# EAGLE design TR Switch (EAGLE 7.2.0)
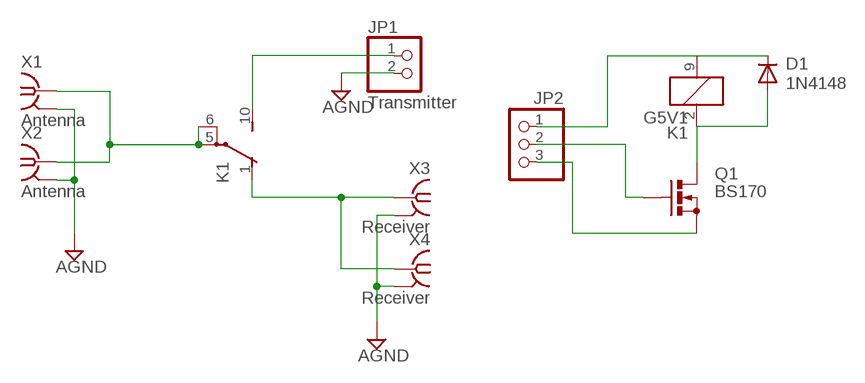
[diagram p0: schematic, sheet 1]

## Parts
D1  1N4148  1N4148DO35-7  [DO35-7]
JP1  Transmitter  PINHD-1X2  [1X02]
JP2  PINHD-1X3  [1X03]
K1  G5V1  [G5V1]
Q1  BS170  [SOT54E]
X1  Antenna  SMA-142-0711-821/826  [J502-ND-142-0711-821/826]
X2  Antenna  BU-SMA-V  [BU-SMA-V]
X3  Receiver  SMA-142-0711-821/826  [J502-ND-142-0711-821/826]
X4  Receiver  BU-SMA-V  [BU-SMA-V]

## Nets
AGND: JP1.2 X1.G@1 X1.G@2 X1.G@3 X1.G@4 X2.2 X2.3 X2.4 X2.5 X3.G@1 X3.G@2 X3.G@3 X3.G@4 X4.2 X4.3 X4.4 X4.5
N$1: D1.A K1.2 Q1.D
N$2: D1.C JP2.1 K1.9
N$3: K1.5(2:P) K1.6(2:P) X1.1 X2.1
N$4: JP2.3 Q1.S
N$5: JP1.1 K1.10(2:S)
N$6: K1.1(2:O) X3.1 X4.1
N$7: JP2.2 Q1.G

## Library data of the parts
D1 = diode:1N4148: DIODE high speed (Philips)
JP1 = pinhead:PINHD-1X2: PIN HEADER
JP2 = pinhead:PINHD-1X3: PIN HEADER
K1 = relay:G5V1: RELAY 1 x switch, 0.5 A/125 V AC, 1 A/24 V DC , Omron; MPN: G5V-1-DC24; OC_FARNELL: 9949593; OC_NEWARK: 36M6377
Q1 = transistor-small-signal:BS170: N-CHANNEL MOS FET
X1 X3 = con-coax:SMA-: SMA 50 Ohm End Launch Jack Receptacle - Round Contact Johnson Components Source: www.johnsoncomponents.com .. J502-ND.pdf; MF: JOHNSON COMPONENTS; MPN: 142-0711-821; OC_FARNELL: 1019328; OC_NEWARK: 16F3627
X2 X4 = con-coax:BU-SMA-V: FEMALE SMA CONNECTOR Radiall distributor RS 112-3794; OC_FARNELL: unknown; OC_NEWARK: unknown

## Board
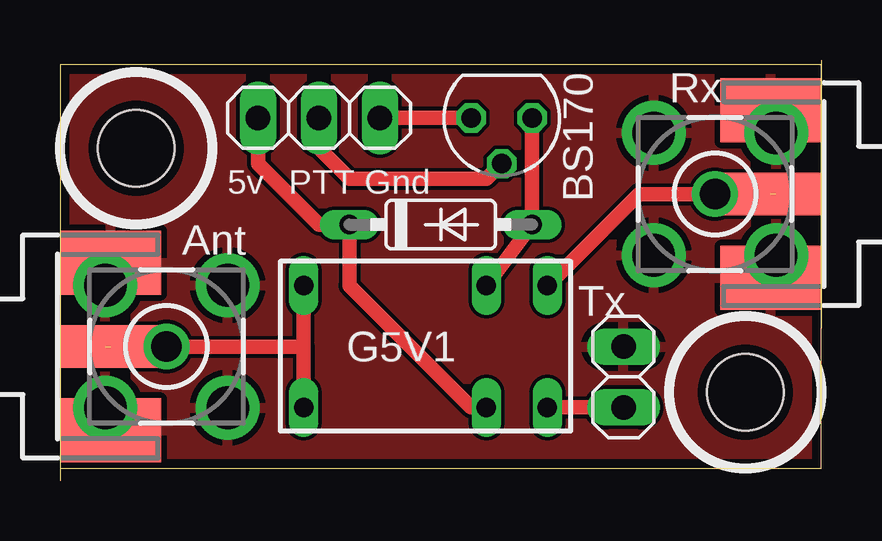
[diagram p1: board, top side]
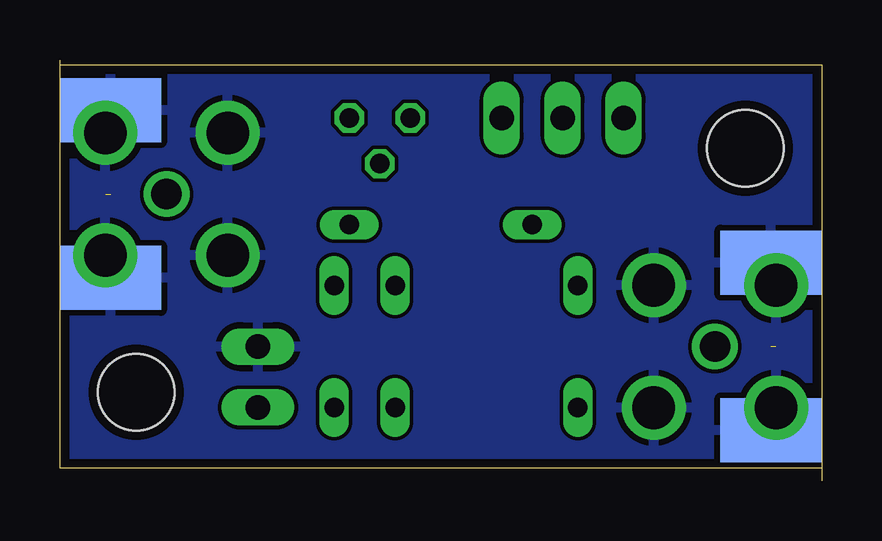
[diagram p2: board, bottom side, seen from below]

Size 31.73 x 16.82 mm. Coordinates in mm from the lower left corner, seen from the top.
Outline: 0,0 31.73,0 31.73,16.82 0,16.82 0,0
Copper layers (1*16): Top 0.0356mm / dielectric 1.5011mm / Bottom 0.0356mm
Design rules "oshpark-2layer": minimum track width 6mil, minimum drill 13mil, track to track 6mil, track to pad 6mil, pad to pad 6mil, via to via 6mil, smd to smd 6mil, copper to edge 15mil, drill to drill 6mil, minimum pad ring 7mil, minimum via ring 7mil, stop-mask expansion 4mil, vias tented up to drill 0mil, thermal gap 10mil
Holes 3.2 mm at 3.17,13.34 28.57,3.17

### Footprints (pad centres in the part's own frame; a part is rotated, then mirrored left to right if it is on the bottom)
DO35-7 = drill 0.813 long: A 3.81,0; C -3.81,0
1X02 = drill 1.016 long: 1 -1.27,0; 2 1.27,0
1X03 = drill 1.016 long: 1 -2.54,0; 2 0,0; 3 2.54,0
G5V1 = drill 0.813 long: 1 -5.08,-2.54; 2 -2.54,-2.54; 5 5.08,-2.54; 6 5.08,2.54; 9 -2.54,2.54; 10 -5.08,2.54
SOT54E = drill 0.813 octagon: D -1.27,0; G 0,1.905; S 1.27,0
J502-ND-142-0711-821/826 = smd 4.191 x 1.778: 1 2.115,0 | smd 4.191 x 2.667: G@1 2.115,3.495; G@2 2.115,-3.495 | smd 4.191 x 2.667 bottom: G@3 2.115,3.495; G@4 2.115,-3.495
BU-SMA-V = drill 1.27: 1 0,0 | drill 1.778: 2 -2.55,2.55; 3 2.55,2.55; 4 2.55,-2.55; 5 -2.55,-2.55

### Placement (x,y rotation side)
D1  15.88,10.16 0 top
JP1  23.5,3.81 90 top
JP2  10.79,14.61 0 top
K1  15.24,5.08 180 top
Q1  18.41,14.61 180 top
X1  0,5.08 0 top
X2  4.45,5.08 0 top
X3  31.75,11.43 180 top
X4  27.3,11.43 0 top

### Tracks (layer width: path | path; a pad name or v marks a point on that pad's centre or on a via)
AGND
  pour Bottom: 0,17.14 35.56,17.14 35.56,0 0,0
  pour Top: 0,17.14 35.56,17.14 35.56,0 0,0
N$1
  Top 0.61: Q1.D D1.A K1.2
N$2
  Top 0.61: JP2.1 8.26,12.7 10.79,10.16 D1.C 12.06,7.62 17.14,2.54 K1.9
N$3  (1 unrouted)
  Top 0.61: 1.91,5.08 X2.1 10.16,5.08 | 10.16,5.08 K1.5 | 10.16,5.08 K1.6
N$4
  Top 0.61: Q1.S JP2.3
N$5
  Top 0.61: K1.10 JP1.1
N$6  (1 unrouted)
  Top 0.61: K1.1 24.13,11.43 X4.1 29.84,11.43
N$7
  Top 0.61: JP2.2 10.79,13.34 12.06,12.06 17.78,12.06 Q1.G

### Text on the board
tPlace: Rx | 5v | PTT | Gnd | Ant | Tx